# Altium schematic sheet backplane.SchDoc
size A
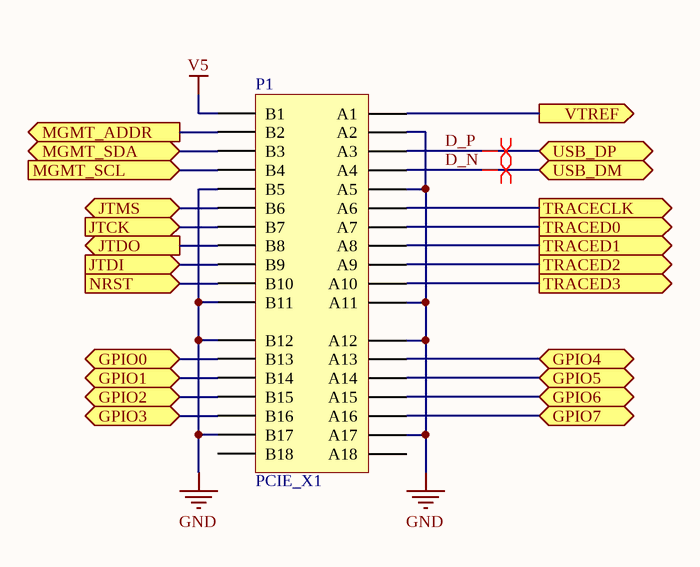
[diagram p0: backplane.SchDoc]

## Parts
P1  PCIE_X1  [PCIE_X1_EDGE]

## Ports
GPIO0 (bidir), GPIO1 (bidir), GPIO2 (bidir), GPIO3 (bidir), GPIO4 (bidir), GPIO5 (bidir), GPIO6 (bidir), GPIO7 (bidir), JTCK (in), JTDI (in), JTDO (out), JTMS (bidir), MGMT_ADDR (out), MGMT_SCL (in), MGMT_SDA (bidir), NRST (in), TRACECLK (out), TRACED0 (out), TRACED1 (out), TRACED2 (out), TRACED3 (out), USB_DM (bidir), USB_DP (bidir), VTREF (out)

## Nets
GND: P1.A2 P1.A5 P1.A11 P1.A12 P1.A17 P1.B5 P1.B11 P1.B12 P1.B17
V5: P1.B1
D_N: P1.A4 ; port USB_DM
D_P: P1.A3 ; port USB_DP
GPIO0: P1.B13 ; port GPIO0
GPIO1: P1.B14 ; port GPIO1
GPIO2: P1.B15 ; port GPIO2
GPIO3: P1.B16 ; port GPIO3
GPIO4: P1.A13 ; port GPIO4
GPIO5: P1.A14 ; port GPIO5
GPIO6: P1.A15 ; port GPIO6
GPIO7: P1.A16 ; port GPIO7
JTCK: P1.B7 ; port JTCK
JTDI: P1.B9 ; port JTDI
JTDO: P1.B8 ; port JTDO
JTMS: P1.B6 ; port JTMS
MGMT_ADDR: P1.B2 ; port MGMT_ADDR
MGMT_SCL: P1.B4 ; port MGMT_SCL
MGMT_SDA: P1.B3 ; port MGMT_SDA
NRST: P1.B10 ; port NRST
TRACECLK: P1.A6 ; port TRACECLK
TRACED0: P1.A7 ; port TRACED0
TRACED1: P1.A8 ; port TRACED1
TRACED2: P1.A9 ; port TRACED2
TRACED3: P1.A10 ; port TRACED3
VTREF: P1.A1 ; port VTREF

Not connected (* = marked no-connect by the designer): P1 A18 B18

## Layout directives
differential pair: D_N, D_P